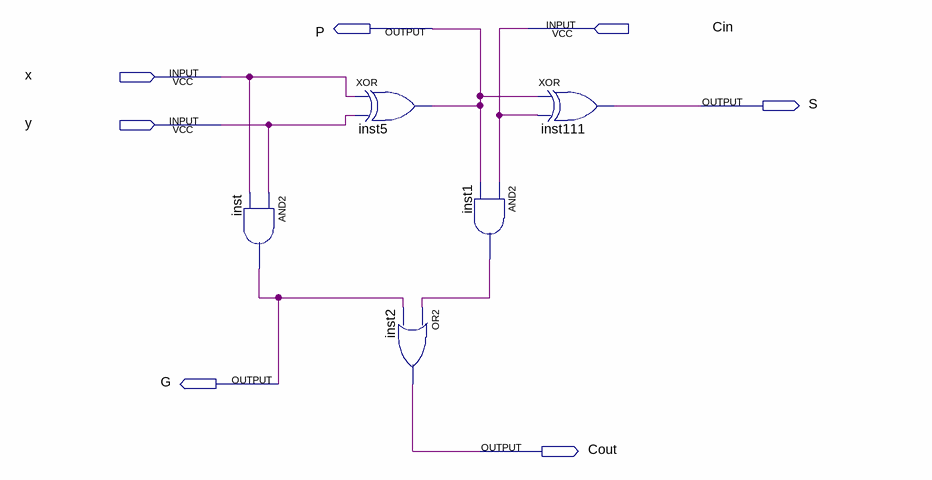
[diagram p0: schematic sheet]
// Quartus schematic plus.bdf as structural Verilog: 5 symbols, 7 pins
module plus (
  input  Cin,
  input  x,
  input  y,
  output P,
  output S,
  output G,
  output Cout
);

  wire inst1_out;

  and inst (G, y, x);
  xor inst5 (P, x, y);
  or inst2 (Cout, inst1_out, G);
  and inst1 (inst1_out, Cin, P);
  xor inst111 (S, P, Cin);
endmodule
